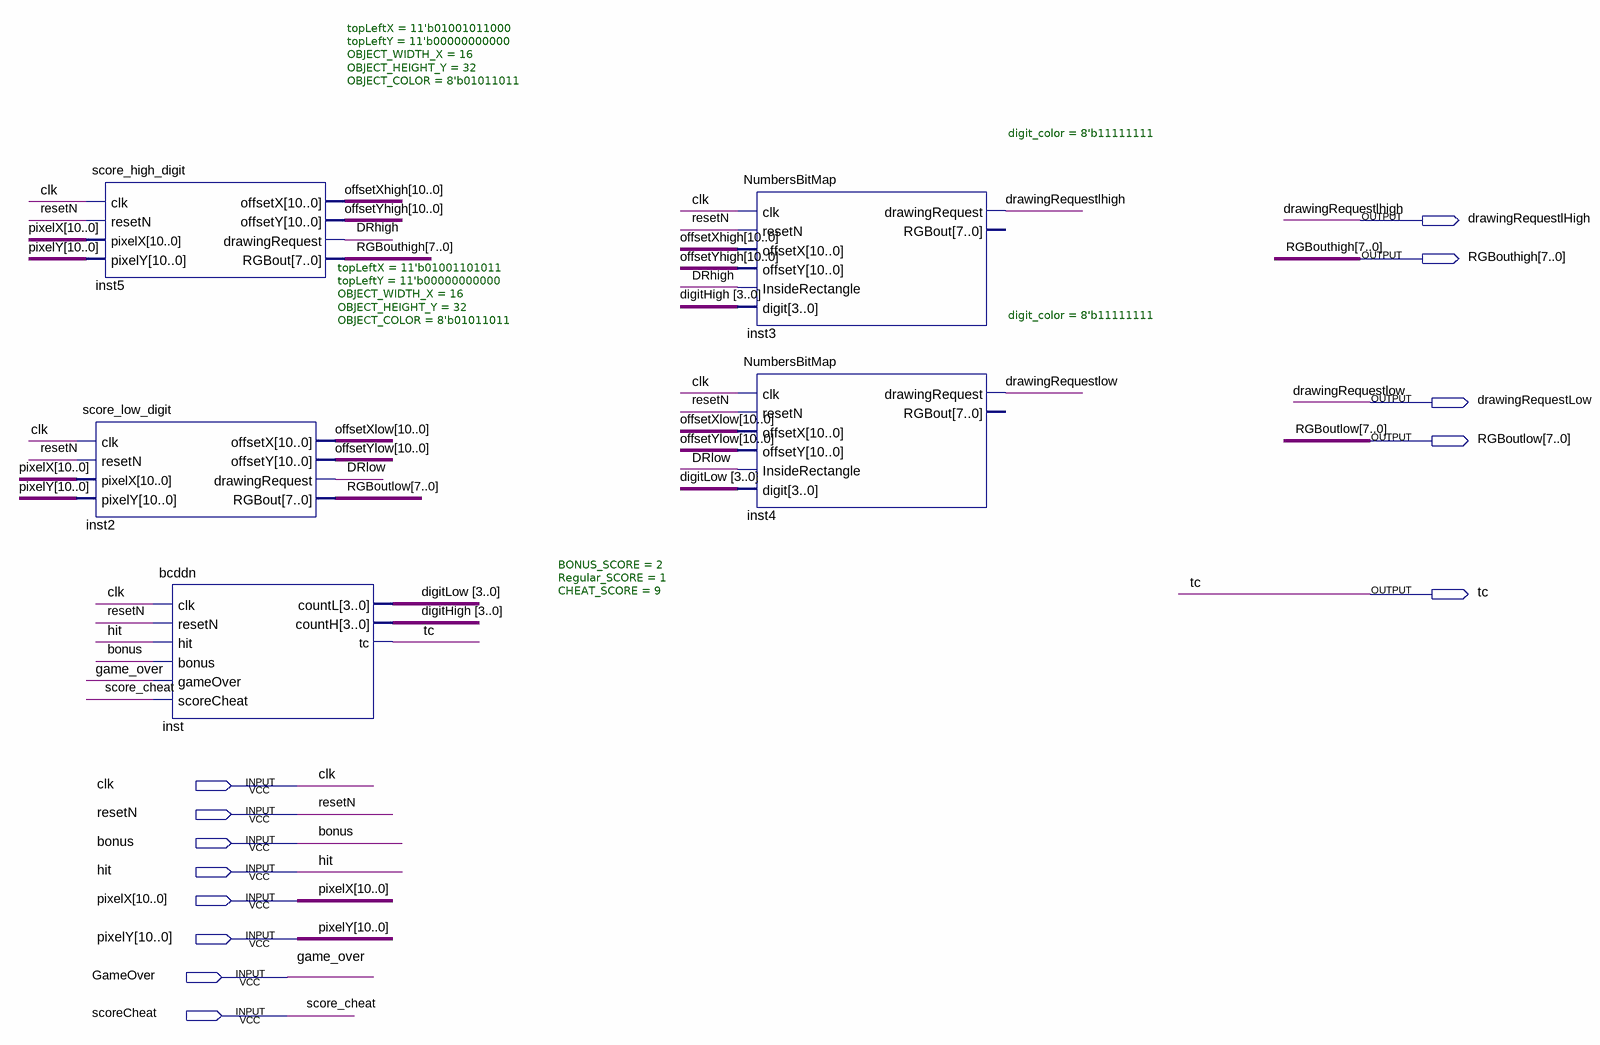
[diagram p0: schematic sheet]
// Quartus schematic ScoreBlock.bdf as structural Verilog: 5 symbols, 13 pins
module ScoreBlock (
  input  clk,
  input  resetN,
  input  bonus,
  input  hit,
  input  [10:0] pixelX,
  input  [10:0] pixelY,
  input  GameOver,
  input  scoreCheat,
  output drawingRequestlHigh,
  output [7:0] RGBouthigh,
  output drawingRequestLow,
  output [7:0] RGBoutlow,
  output tc
);

  wire DRhigh, DRlow;
  wire [3:0] digitHigh, digitLow;
  wire [10:0] offsetXhigh, offsetXlow, offsetYhigh, offsetYlow;

  score_high_digit #(.topLeftX(11'b01001011000), .topLeftY(11'b00000000000), .OBJECT_WIDTH_X(16), .OBJECT_HEIGHT_Y(32), .OBJECT_COLOR(8'b01011011)) inst5 (
    .clk(clk), .resetN(resetN), .pixelX(pixelX), .pixelY(pixelY), .offsetX(offsetXhigh),
    .offsetY(offsetYhigh), .drawingRequest(DRhigh), .RGBout(RGBouthigh));
  score_low_digit #(.topLeftX(11'b01001101011), .topLeftY(11'b00000000000), .OBJECT_WIDTH_X(16), .OBJECT_HEIGHT_Y(32), .OBJECT_COLOR(8'b01011011)) inst2 (
    .clk(clk), .resetN(resetN), .pixelX(pixelX), .pixelY(pixelY), .offsetX(offsetXlow), .offsetY(offsetYlow),
    .drawingRequest(DRlow), .RGBout(RGBoutlow));
  bcddn #(.BONUS_SCORE(2), .Regular_SCORE(1), .CHEAT_SCORE(9)) inst (
    .clk(clk), .resetN(resetN), .hit(hit), .bonus(bonus), .gameOver(GameOver), .scoreCheat(scoreCheat),
    .countL(digitLow), .countH(digitHigh), .tc(tc));
  NumbersBitMap #(.digit_color(8'b11111111)) inst3 (
    .clk(clk), .resetN(resetN), .offsetX(offsetXhigh), .offsetY(offsetYhigh), .InsideRectangle(DRhigh),
    .digit(digitHigh), .drawingRequest(drawingRequestlHigh));  // open: RGBout
  NumbersBitMap #(.digit_color(8'b11111111)) inst4 (
    .clk(clk), .resetN(resetN), .offsetX(offsetXlow), .offsetY(offsetYlow), .InsideRectangle(DRlow),
    .digit(digitLow), .drawingRequest(drawingRequestLow));  // open: RGBout

  // Other names for the same wires on the sheet: game_over = GameOver; score_cheat = scoreCheat
endmodule
